# Altium schematic sheet 红外遥控小车.SchDoc
size A4
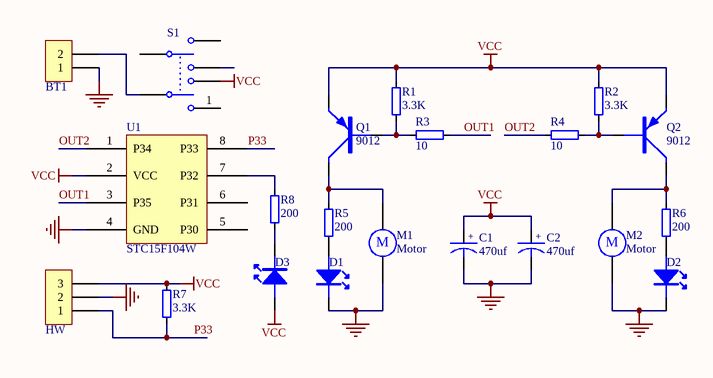
[diagram p0: 红外遥控小车.SchDoc]

## Parts
BT1  CON2  [CON2--5.08]  (value not drawn)
C1  CAPACITOR POL  [电容D=8mm]  (value not drawn)
C2  CAPACITOR POL  [电容D=8mm]  (value not drawn)
D1  LED  [DIODE0.1]  (value not drawn)
D2  LED  [DIODE0.1]  (value not drawn)
D3  LED  [DIODE0.1]  (value not drawn)
HW  CON3  [红外接收头]  (value not drawn)
M1  Motor  [CON2--5.08]
M2  Motor  [CON2--5.08]
Q1  9012  [8050-TO-92]
Q2  9012  [8050-TO-92]
R1  RES  [RES-0.25W]  (value not drawn)
R2  RES  [RES-0.25W]  (value not drawn)
R3  RES  [RES-0.25W]  (value not drawn)
R4  RES  [RES-0.25W]  (value not drawn)
R5  RES  [RES-0.25W]  (value not drawn)
R6  RES  [RES-0.25W]  (value not drawn)
R7  RES  [RES-0.25W]  (value not drawn)
R8  RES  [RES-0.25W]  (value not drawn)
S1  SW-DPDT  [自锁6*6]  (value not drawn)
U1  STC15F104W  [DIP8]

## Nets
GND: BT1.1 C1.2 C2.2 D1.2 D2.2 HW.2 M1.2 M2.2 U1.4(GND)
VCC: C1.1 C2.1 D3.1 HW.3 Q1.1(E) Q2.1(E) R1.2 R2.2 R7.2 S1.2 U1.2(VCC)
OUT1: R3.1 U1.3(P35)
OUT2: R4.2 U1.1(P34)
P33: HW.1 R7.1 U1.8(P33)
NetBT1_2: BT1.2 S1.3
NetD1_1: D1.1 R5.1
NetD2_1: D2.1 R6.1
NetD3_2: D3.2 R8.2
NetM1_1: M1.1 Q1.3(C) R5.2
NetM2_1: M2.1 Q2.3(C) R6.2
NetQ1_2: Q1.2(B) R1.1 R3.2
NetQ2_2: Q2.2(B) R2.1 R4.1
NetR8_1: R8.1 U1.7(P32)

Not connected (* = marked no-connect by the designer): S1 1 4 5 6; U1 5(P30) 6(P31)

## Notes on the sheet
- (in symbol CAPACITOR POL) +; 470uf
- (in symbol Motor) M
- (in symbol RES) 200; 10; 3.3K

## Library data of the parts
BT1 = CON2: Connector
C1 C2 = CAPACITOR POL: Capacitor
HW = CON3: Connector
M1 M2 = Motor: Motor, General Kind; Published: 24-Mar-1999; LatestRevisionDate: 17-Jul-2002; LatestRevisionNote: Re-released for DXP Platform.; PackageReference: RB5-10.5; Publisher: Altium Limited
Q1 Q2 = 8550: PNP Transistor
S1 = SW-DPDT: Double-Pole, Double-Throw Switch; Published: 24-Mar-1999; LatestRevisionDate: 17-Jul-2002; LatestRevisionNote: Re-released for DXP Platform.; PackageReference: DPDT-6; Publisher: Altium Limited
U1 = DIP8